# Altium schematic sheet NB3000_Edge_Detection.SchDoc
size B
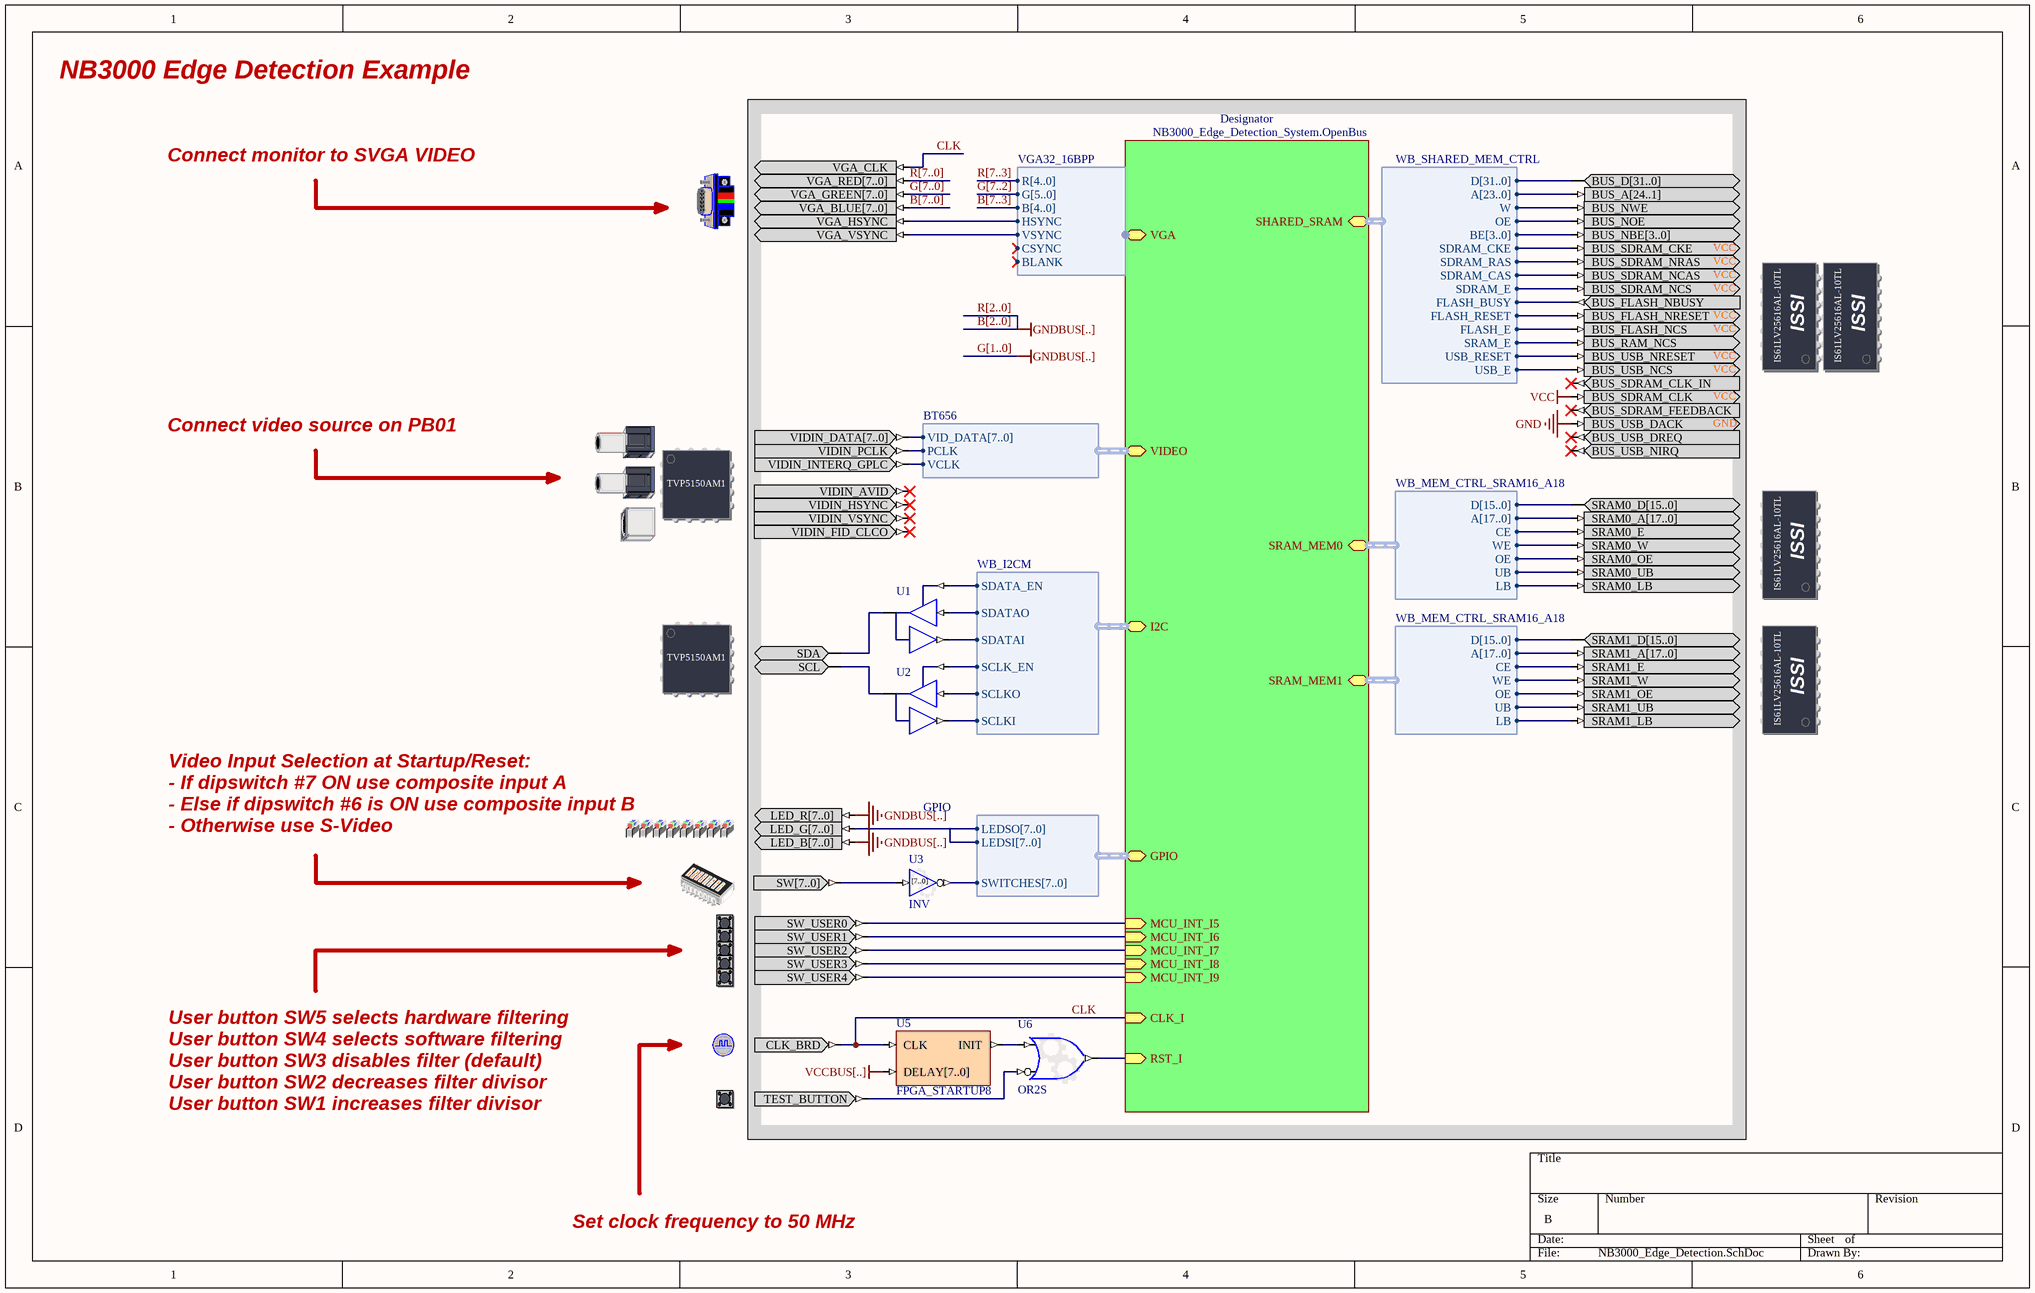
[diagram p0: NB3000_Edge_Detection.SchDoc]

## Parts
(Parts that share a designator on the sheet are numbered #1, #2 ... from top to bottom, then left to right.)
?#1  VGACNTR  (value not drawn)
?#2  SHARED_SRAM  (value not drawn)
?#3  VIDEO_INPUT  (value not drawn)
?#4  SRAM0  (value not drawn)
?#5  VIDEO_INPUT_CTRL  (value not drawn)
?#6  SRAM1  (value not drawn)
?#7  LEDS_RGB  (value not drawn)
?#8  DIPSWITCH  (value not drawn)
?#9  USER_BUTTON0  (value not drawn)
?#10  USER_BUTTON1  (value not drawn)
?#11  USER_BUTTON2  (value not drawn)
?#12  USER_BUTTON3  (value not drawn)
?#13  USER_BUTTON4  (value not drawn)
?#14  CLOCK_BOARD  (value not drawn)
?#15  TEST_BUTTON  (value not drawn)
U1  IOBUF  (value not drawn)
U2  IOBUF  (value not drawn)
U3  INV
U5  FPGA_STARTUP8
U6  OR2S

## Sub-sheets
Designator = NB3000_Edge_Detection_System.OpenBus: MCU_INT_I5 (in), MCU_INT_I6 (in), MCU_INT_I7 (in), MCU_INT_I8 (in), MCU_INT_I9 (in), RST_I (in), CLK_I (in), SRAM_MEM0 (harness WB_MEM_CTRL_SRAM16_A18), SRAM_MEM1 (harness WB_MEM_CTRL_SRAM16_A18), GPIO (harness GPIO), I2C (harness WB_I2CM), VIDEO (harness BT656), VGA (harness VGA32_16BPP), SHARED_SRAM (harness WB_SHARED_MEM_CTRL)

## Harnesses
WB_MEM_CTRL_SRAM16_A18: D[15..0], A[17..0], CE, WE, OE, UB, LB
VGA32_16BPP: R[4..0], G[5..0], B[4..0], HSYNC, VSYNC, CSYNC, BLANK
WB_I2CM: SDATA_EN, SDATAO, SDATAI, SCLK_EN, SCLKO, SCLKI
BT656: VID_DATA[7..0], PCLK, VCLK
GPIO: LEDSO[7..0], LEDSI[7..0], SWITCHES[7..0]
WB_SHARED_MEM_CTRL: D[31..0], A[23..0], W, OE, BE[3..0], SDRAM_CKE, SDRAM_RAS, SDRAM_CAS, SDRAM_E, FLASH_BUSY, FLASH_RESET, FLASH_E, SRAM_E, USB_RESET, USB_E

## Nets
B[2..0]: ?#7.LED_B[7..0] ?#7.LED_R[7..0]  [also labelled G[1..0], GNDBUS[..], R[2..0]]
GND: ?#2.BUS_USB_DACK
VCC: ?#2.BUS_SDRAM_CLK
VCCBUS[..]: U5.DELAY[7..0]
B[7..0]: ?#1.VGA_BLUE[7..0]
CLK: ?#1.VGA_CLK ?#14.CLK_BRD U5.CLK ; sheet Designator/CLK_I
G[7..0]: ?#1.VGA_GREEN[7..0]
R[7..0]: ?#1.VGA_RED[7..0]
Net?#1_VGA_HSYNC: ?#1.VGA_HSYNC ; sheet Designator/VGA.HSYNC
Net?#1_VGA_VSYNC: ?#1.VGA_VSYNC ; sheet Designator/VGA.VSYNC
Net?#2_BUS_A[24..1]: ?#2.BUS_A[24..1] ; sheet Designator/SHARED_SRAM.A[23..0]
Net?#2_BUS_D[31..0]: ?#2.BUS_D[31..0] ; sheet Designator/SHARED_SRAM.D[31..0]
Net?#2_BUS_FLASH_NBUSY: ?#2.BUS_FLASH_NBUSY ; sheet Designator/SHARED_SRAM.FLASH_BUSY
Net?#2_BUS_FLASH_NCS: ?#2.BUS_FLASH_NCS ; sheet Designator/SHARED_SRAM.FLASH_E
Net?#2_BUS_FLASH_NRESET: ?#2.BUS_FLASH_NRESET ; sheet Designator/SHARED_SRAM.FLASH_RESET
Net?#2_BUS_NBE[3..0]: ?#2.BUS_NBE[3..0] ; sheet Designator/SHARED_SRAM.BE[3..0]
Net?#2_BUS_NOE: ?#2.BUS_NOE ; sheet Designator/SHARED_SRAM.OE
Net?#2_BUS_NWE: ?#2.BUS_NWE ; sheet Designator/SHARED_SRAM.W
Net?#2_BUS_RAM_NCS: ?#2.BUS_RAM_NCS ; sheet Designator/SHARED_SRAM.SRAM_E
Net?#2_BUS_SDRAM_CKE: ?#2.BUS_SDRAM_CKE ; sheet Designator/SHARED_SRAM.SDRAM_CKE
Net?#2_BUS_SDRAM_NCAS: ?#2.BUS_SDRAM_NCAS ; sheet Designator/SHARED_SRAM.SDRAM_CAS
Net?#2_BUS_SDRAM_NCS: ?#2.BUS_SDRAM_NCS ; sheet Designator/SHARED_SRAM.SDRAM_E
Net?#2_BUS_SDRAM_NRAS: ?#2.BUS_SDRAM_NRAS ; sheet Designator/SHARED_SRAM.SDRAM_RAS
Net?#2_BUS_USB_NCS: ?#2.BUS_USB_NCS ; sheet Designator/SHARED_SRAM.USB_E
Net?#2_BUS_USB_NRESET: ?#2.BUS_USB_NRESET ; sheet Designator/SHARED_SRAM.USB_RESET
Net?#3_VIDIN_DATA[7..0]: ?#3.VIDIN_DATA[7..0] ; sheet Designator/VIDEO.VID_DATA[7..0]
Net?#3_VIDIN_INTERQ_GPLC: ?#3.VIDIN_INTERQ_GPLC ; sheet Designator/VIDEO.VCLK
Net?#3_VIDIN_PCLK: ?#3.VIDIN_PCLK ; sheet Designator/VIDEO.PCLK
Net?#4_SRAM0_A[17..0]: ?#4.SRAM0_A[17..0] ; sheet Designator/SRAM_MEM0.A[17..0]
Net?#4_SRAM0_D[15..0]: ?#4.SRAM0_D[15..0] ; sheet Designator/SRAM_MEM0.D[15..0]
Net?#4_SRAM0_E: ?#4.SRAM0_E ; sheet Designator/SRAM_MEM0.CE
Net?#4_SRAM0_LB: ?#4.SRAM0_LB ; sheet Designator/SRAM_MEM0.LB
Net?#4_SRAM0_OE: ?#4.SRAM0_OE ; sheet Designator/SRAM_MEM0.OE
Net?#4_SRAM0_UB: ?#4.SRAM0_UB ; sheet Designator/SRAM_MEM0.UB
Net?#4_SRAM0_W: ?#4.SRAM0_W ; sheet Designator/SRAM_MEM0.WE
Net?#5_SCL: ?#5.SCL U2.IO
Net?#5_SDA: ?#5.SDA U1.IO
Net?#6_SRAM1_A[17..0]: ?#6.SRAM1_A[17..0] ; sheet Designator/SRAM_MEM1.A[17..0]
Net?#6_SRAM1_D[15..0]: ?#6.SRAM1_D[15..0] ; sheet Designator/SRAM_MEM1.D[15..0]
Net?#6_SRAM1_E: ?#6.SRAM1_E ; sheet Designator/SRAM_MEM1.CE
Net?#6_SRAM1_LB: ?#6.SRAM1_LB ; sheet Designator/SRAM_MEM1.LB
Net?#6_SRAM1_OE: ?#6.SRAM1_OE ; sheet Designator/SRAM_MEM1.OE
Net?#6_SRAM1_UB: ?#6.SRAM1_UB ; sheet Designator/SRAM_MEM1.UB
Net?#6_SRAM1_W: ?#6.SRAM1_W ; sheet Designator/SRAM_MEM1.WE
Net?#7_LED_G[7..0]: ?#7.LED_G[7..0] ; sheet Designator/GPIO.LEDSO[7..0], sheet Designator/GPIO.LEDSI[7..0]
Net?#8_SW[7..0]: ?#8.SW[7..0] U3.I[7..0]
Net?#9_SW_USER0: ?#9.SW_USER0 ; sheet Designator/MCU_INT_I5
Net?#10_SW_USER1: ?#10.SW_USER1 ; sheet Designator/MCU_INT_I6
Net?#11_SW_USER2: ?#11.SW_USER2 ; sheet Designator/MCU_INT_I7
Net?#12_SW_USER3: ?#12.SW_USER3 ; sheet Designator/MCU_INT_I8
Net?#13_SW_USER4: ?#13.SW_USER4 ; sheet Designator/MCU_INT_I9
Net?#15_TEST_BUTTON: ?#15.TEST_BUTTON U6.I1
NetU1_I: U1.I ; sheet Designator/I2C.SDATAO
NetU1_O: U1.O ; sheet Designator/I2C.SDATAI
NetU1_T: U1.T ; sheet Designator/I2C.SDATA_EN
NetU2_I: U2.I ; sheet Designator/I2C.SCLKO
NetU2_O: U2.O ; sheet Designator/I2C.SCLKI
NetU2_T: U2.T ; sheet Designator/I2C.SCLK_EN
NetU3_O[7..0]: U3.O[7..0] ; sheet Designator/GPIO.SWITCHES[7..0]
NetU5_INIT: U5.INIT U6.I0
NetU6_O: U6.O ; sheet Designator/RST_I

Not connected (* = marked no-connect by the designer): ?#2 BUS_SDRAM_CLK_IN* BUS_SDRAM_FEEDBACK* BUS_USB_DREQ* BUS_USB_NIRQ*; ?#3 VIDIN_AVID* VIDIN_FID_CLCO* VIDIN_HSYNC* VIDIN_VSYNC*

## Buses and harness runs
bus B[2..0] = R[2..0]
bus B[7..0]
bus B[7..3]
bus G[1..0]
bus G[7..0]
bus G[7..2]
bus R[7..0]
bus R[7..3]

## Notes on the sheet
- NB3000 Edge Detection Example
- Connect monitor to SVGA VIDEO
- Connect video source on PB01
- Video Input Selection at Startup/Reset:
  - If dipswitch #7 ON use composite input A
  - Else if dipswitch #6 is ON use composite input B
  - Otherwise use S-Video
- User button SW5 selects hardware filtering
  User button SW4 selects software filtering
  User button SW3 disables filter (default)
  User button SW2 decreases filter divisor
  User button SW1 increases filter divisor
- Set clock frequency to 50 MHz
- (in symbol DIPSWITCH) ON; 1; 2; 3; 4; 5; 6; 7; 8
- (in symbol INV) [7..0]
- (in symbol SHARED_SRAM) VCC; ISSI; IS61LV25616AL-10TL; GND
- (in symbol SRAM0) ISSI; IS61LV25616AL-10TL
- (in symbol SRAM1) ISSI; IS61LV25616AL-10TL
- (in symbol VIDEO_INPUT) TVP5150AM1
- (in symbol VIDEO_INPUT_CTRL) TVP5150AM1

## Library data of the parts
?#1 = VGACNTR: VGA Dsub-15-Female-HD; PortComponent: True; Published: 14-May-2007; Publisher: Altium Limited; HelpURL: https://wiki.altium.com/display/ADOH/NanoBoard+3000+-+Video+Output
?#2 = SHARED_SRAM: Common-Bus SRAM; PortComponent: True; Published: 14-May-2007; Publisher: Altium Limited; HelpURL: https://wiki.altium.com/display/ADOH/Accessing+Common-Bus+Resources+on+the+NanoBoard+3000
?#3 = VIDEO_INPUT: Video Inputs; PortComponent: True; Published: 22-Jan-2007; Publisher: Altium Limited; HelpURL: https://wiki.altium.com/display/ADOH/PB01+Resources+-+Video+Input+Capture
?#4 = SRAM0: Free Static RAM - Daughterboard; PortComponent: True; Published: 14-May-2007; Publisher: Altium Limited; HelpURL: https://wiki.altium.com/display/ADOH/NanoBoard+3000+-+Independent+SRAM
?#5 = VIDEO_INPUT_CTRL: Video Input Control; PortComponent: True; Published: 22-Jan-2007; Publisher: Altium Limited; HelpURL: https://wiki.altium.com/display/ADOH/PB01+Resources+-+Video+Input+Capture
?#6 = SRAM1: Free Static RAM - Daughterboard; PortComponent: True; Published: 14-May-2007; Publisher: Altium Limited; HelpURL: https://wiki.altium.com/display/ADOH/NanoBoard+3000+-+Independent+SRAM
?#7 = LEDS_RGB: LEDS RGB; PortComponent: True; Published: 11-Mar-2009; Publisher: Altium Limited; HelpURL: https://wiki.altium.com/display/ADOH/NanoBoard+3000+-+RGB+User+LEDs
?#8 = DIPSWITCH: 8-Way Dip-Switch; PortComponent: True; Published: 19-Nov-2003; Publisher: Altium Limited; HelpURL: https://wiki.altium.com/display/ADOH/NanoBoard+3000+-+User+DIP-Switch
?#9 = USER_BUTTON0: Generic User Button; PortComponent: True; Published: 16-Apr-2007; Publisher: Altium Limited; HelpURL: https://wiki.altium.com/display/ADOH/NanoBoard+3000+-+Generic+User+Switches
?#10 = USER_BUTTON1: Generic User Button; PortComponent: True; Published: 16-Apr-2007; Publisher: Altium Limited; HelpURL: https://wiki.altium.com/display/ADOH/NanoBoard+3000+-+Generic+User+Switches
?#11 = USER_BUTTON2: Generic User Button; PortComponent: True; Published: 16-Apr-2007; Publisher: Altium Limited; HelpURL: https://wiki.altium.com/display/ADOH/NanoBoard+3000+-+Generic+User+Switches
?#12 = USER_BUTTON3: Generic User Button; PortComponent: True; Published: 16-Apr-2007; Publisher: Altium Limited; HelpURL: https://wiki.altium.com/display/ADOH/NanoBoard+3000+-+Generic+User+Switches
?#13 = USER_BUTTON4: Generic User Button; PortComponent: True; Published: 16-Apr-2007; Publisher: Altium Limited; HelpURL: https://wiki.altium.com/display/ADOH/NanoBoard+3000+-+Generic+User+Switches
?#14 = CLOCK_BOARD: Global System Clock Supply; PortComponent: True; Published: 19-Nov-2003; Publisher: Altium Limited; HelpURL: TR0143 Technical Reference Manual for Altium's Desktop NanoBoard NB2DSK01.pdf#page=41; UseInDSF: True
?#15 = TEST_BUTTON: Test / Reset Button; PortComponent: True; Published: 19-Nov-2003; Publisher: Altium Limited; HelpURL: TR0143 Technical Reference Manual for Altium's Desktop NanoBoard NB2DSK01.pdf#page=53
U1 U2 = IOBUF: Input/Output Buffer; Enable: Low; Control: Common Control T; ArchiveName: GENERIC; VHDLIB_SIM: GENERIC_LIB; Published: 29-Jan-2004; Publisher: Altium Limited; XilinxEquivalent: IOBUF; LastRevisionNo: 1.00.00; HelpURL: CR0118 FPGA Generic Library Guide.pdf#page=292; ComponentLink1URL: CR0125 FPGA Buffer Resource Usage.pdf#page=78; ComponentLink1Description: Core &Resource Usage; FunctionalClass: Buffer; SubClass: IOBUF
U3 = INV: Configurable Inverter; ConfigurationParameters: {}Version[1.0]{}SignalCount[1]{}SignalWidth0[8]{}OutputOption0[Inverted]{}EnableMode[None]{}ShowPinNames[False]{}; ConfiguratorName: GENERIC_BUFFER; LastRevisionNo: 1.00.00; Published: 10-Oct-2008; Publisher: Altium Limited
U5 = FPGA_STARTUP8: FPGA Startup With 8 Bit Delay; Published: 9-Dec-2004; Publisher: Altium Limited; HelpURL: CR0119 FPGA_STARTUPx Powerup Delay Unit.pdf; LastRevisionNo: 1.00.00; ComponentLink1Description: Core &Resource Usage; ComponentLink1URL: CR0139 FPGA Peripheral Resource Usage.pdf#page=11
U6 = GATE: Configurable Generic Gate; ConfiguratorName: GENERIC_GATE; ConfigurationParameters: {}Version[1.0]{}GateKind[OR]{}BusInput[False]{}GateInputType[Bit]{}GateOutputOption[Normal]{}BusWidth[8]{}RegisterOutputs[False]{}NegativeClockEdge[False]{}InputCount[2]{}InputInvert0[False]{}InputInvert1[True]{}; LastRevisionNo: 1.00.00; Published: 3-Sep-2008; Publisher: Altium Limited